# Altium schematic sheet Schematic_page1.SchDoc
size 420 x 297 mm; Author: Дубатовка В.В.; Address1: Address1; Address2: Address2; Address3: Address3; Address4: Address4; DocumentNumber: АБВГ.123456.001 Э3; SheetNumber: 1; SheetTotal: 3; Scale: 1:1; DocumentType: Схема электрическая принципиальная; FirstReferrence: АБВГ.123456.001
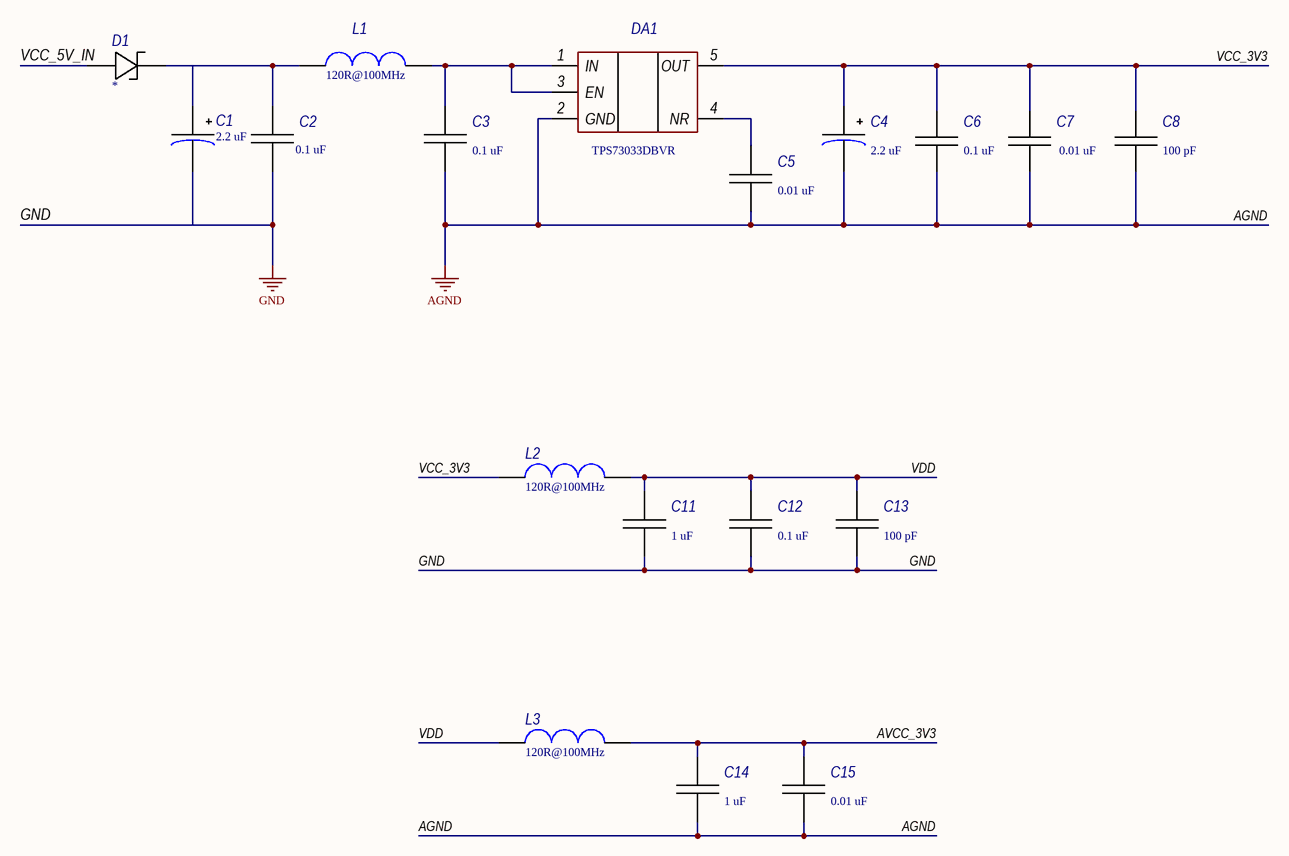
[diagram p0: Schematic_page1.SchDoc]

## Parts
C1  2.2 uF  [TANT-A]
C2  0.1 uF  [C0603]
C3  0.1 uF  [C0603]
C4  2.2 uF  [TANT-A]
C5  0.01 uF  [C0603]
C6  0.1 uF  [C0603]
C7  0.01 uF  [C0603]
C8  100 pF  [C0603]
C11  1 uF  [C0603]
C12  0.1 uF  [C0603]
C13  100 pF  [C0603]
C14  1 uF  [C0603]
C15  0.01 uF  [C0603]
D1  *  [SOD-523]
DA1  TPS73033DBVR  [SOT-23-5]
L1  120R@100MHz  [IND1206]
L2  120R@100MHz  [IND1206]
L3  120R@100MHz  [IND1206]

## Nets
AGND: C3.2 C4.2 C5.2 C6.2 C7.2 C8.2 C14.2 C15.2 DA1.2(GND)
GND: C1.2 C2.2 C11.2 C12.2 C13.2
AVCC_3V3: C14.1 C15.1 L3.2
VCC_3V3: C4.1 C6.1 C7.1 C8.1 DA1.5(OUT) L2.1
VCC_5V_IN: D1.2
VDD: C11.1 C12.1 C13.1 L2.2 L3.1
NetC1_1: C1.1 C2.1 D1.1 L1.1
NetC3_1: C3.1 DA1.1(IN) DA1.3(EN) L1.2
NetC5_1: C5.1 DA1.4(NR)

## Notes on the sheet
- Перв. примен.
- Справ. №
- Подп. и дата
- Инв. № дубл.
- Взам. инв. №
- Разраб.
- Изм.
- Лист
- № докум.
- Подп.
- Дата
- Лит.
- Масса
- Масштаб
- Пров.
- Т.контр.
- Листов
- Инв. № подл.
- Утв.
- Н.контр.
- 2.106-A3
- Копировал
- Формат А3

## Library data of the parts
C1 C4 = Capasitor_Tantalum: Value: 2.2 uF; Case: *; Manufacturer: *; HelpURL: *; Model: *
C2 C3 C5-C8 C11-C15 = Capasitor: Manufacturer: *; HelpURL: *; Model: *
  C2 C3 C12: Value: 0.1 uF; Case: *
  C5 C15: Value: 0.01 uF; Case: *
  C6: Value: 0.1 uF; Case: С0603
  C7: Value: 0.01 uF; Case: С0603
  C8: Value: 100 pF; Case: С0603
  C11 C14: Value: 1 uF; Case: *
  C13: Value: 100 pF; Case: *
D1 = Diode Schottky: Model: *; Manufacturer: *; Case: *; HelpURL: *
DA1 = TPS73033DBV: IC REG LINEAR 3.3V 200MA SOT 23-5; Manufacturer: Texas Instruments; Case: SOT-23-5; HelpURL: https://www.digikey.com/product-detail/en/texas-instruments/TPS73033DBVR/296-17580-1-ND/705377; Model: TPS73033DBVR
L1-L3 = Inductivity: Model: *; Manufacturer: *; HelpURL: *; Case: *; Value: 120R@100MHz